# Altium schematic sheet Modem.SchDoc: MODEM
size A4; Author: MOG; CompanyName: GIE GROUP; DrawnBy: MOG; Organization: Gie SA; Address1: Galicia 52; Address2: Mar del Plata; Address3: Buenos Aires; Address4: Argentina; DocumentNumber: 9; Revision: 0.0; SheetNumber: 4; SheetTotal: 14; Project: CP DATALOGGER; PageSetup: Record=PageOptions|CenterHorizontal=True|CenterVertical=True|PrintScale=0.94|XCorrection=1.00|YCorrection=1.00|PrintKind=0|BorderSize=5000000|LeftOffset=0|BottomOffset=0|Orientation=2|PaperLength=1000|PaperWidth=1000|Scale=100|PaperSource=7|PrintQuality=720|MediaType=1|DitherType=10|PaperKind=A4|PrintScaleMode=1
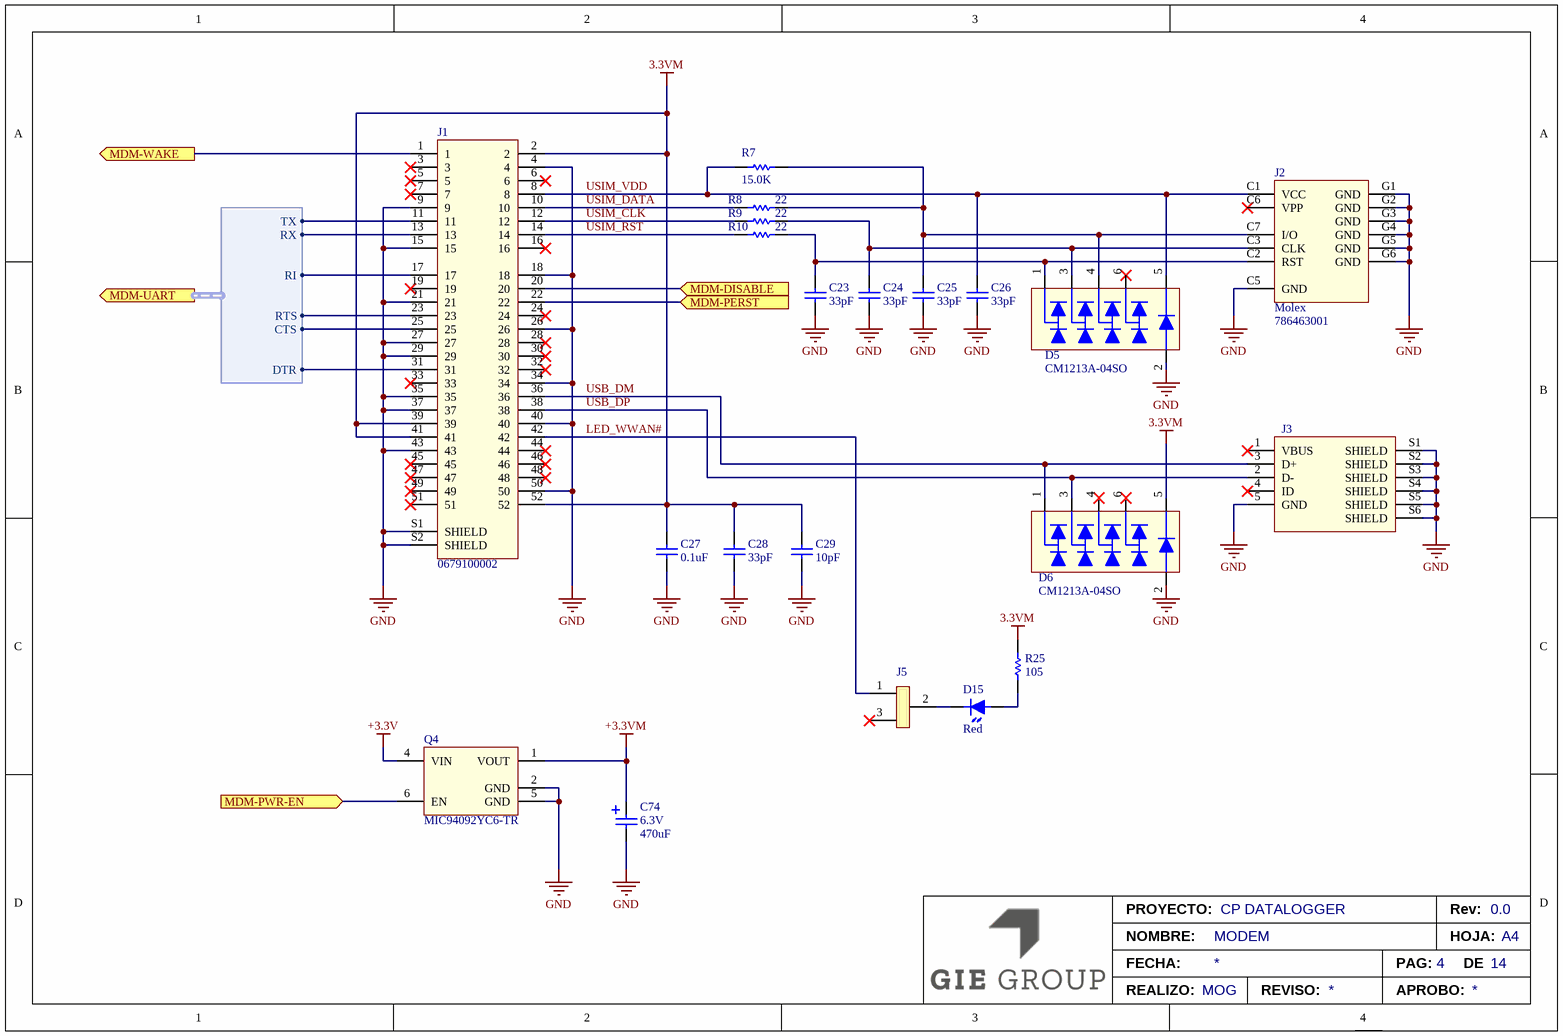
[diagram p0: Modem.SchDoc]

## Parts
C23  value 33pF  [CAP-0603]  (hidden comment: C0603C330F3GAC7867)
C24  value 33pF  [CAP-0603]  (hidden comment: C0603C330F3GAC7867)
C25  value 33pF  [CAP-0603]  (hidden comment: C0603C330F3GAC7867)
C26  value 33pF  [CAP-0603]  (hidden comment: C0603C330F3GAC7867)
C27  value 0.1uF  [CAP-0603]  (hidden comment: C0603C104K5RACAUTO)
C28  value 33pF  [CAP-0603]  (hidden comment: C0603C330F3GAC7867)
C29  value 10pF  [CAP-0603]  (hidden comment: C0603C100K3GAC7867)
C74  value 470uF  Voltage: 6.3V  [CAP_ALUM_SIZE_F]  (hidden comment: EEE-FK0J471P)
D5  CM1213A-04SO  [TSSOP6]
D6  CM1213A-04SO  [TSSOP6]
D15  Color: Red  [0805 - LED]  (hidden comment: LTST-C170KRKT)
J1  0679100002  [MOLEX-679100002]
J2  Manufacturer: Molex  [MOLEX-786463001]  (hidden comment: 786463001)
J3  473460001  [MOLEX-473460001]  (value not drawn)
J5  PRPC003SAAN-RC  [PIN3]  (value not drawn)
Q4  MIC94092YC6-TR  [TSSOP6]
R7  value 15.0K  [RES-0603]  (hidden comment: RC0603FR-0715KL)
R8  value 22  [RES-0603]  (hidden comment: RC0603FR-0722RL)
R9  value 22  [RES-0603]  (hidden comment: RC0603FR-0722RL)
R10  value 22  [RES-0603]  (hidden comment: RC0603FR-0722RL)
R25  value 105  [RES-0603]  (hidden comment: RC0805FR-07100KL)

## Ports
MDM-DISABLE (in), MDM-PERST (in), MDM-PWR-EN (in), MDM-UART (out, harness MDM-UART), MDM-WAKE (out)

## Harnesses
MDM-UART: RX, TX, RI, CTS, RTS, DTR

## Nets
3.3VM: C27.2 C28.2 C29.2 D6.5 J1.2 J1.39 J1.41 J1.52 R25.2
+3.3V: Q4.4(VIN)
+3.3VM: C74.1 Q4.1(VOUT)
GND: C23.1 C24.1 C25.1 C26.1 C27.1 C28.1 C29.1 C74.2 D5.2 D6.2 J1.4 J1.9 J1.15 J1.18 J1.21 J1.26 J1.27 J1.29 J1.34 J1.35 J1.37 J1.40 J1.43 J1.50 J1.S1(SHIELD) J1.S2(SHIELD) J2.C5(GND) J2.G1(GND) J2.G2(GND) J2.G3(GND) J2.G4(GND) J2.G5(GND) J2.G6(GND) J3.5(GND) J3.S1(SHIELD) J3.S2(SHIELD) J3.S3(SHIELD) J3.S4(SHIELD) J3.S5(SHIELD) J3.S6(SHIELD) Q4.2(GND) Q4.5(GND)
LED_WWAN#: J1.42 J5.1
MDM-DISABLE: J1.20 ; port MDM-DISABLE
MDM-PERST: J1.22 ; port MDM-PERST
MDM-PWR-EN: Q4.6(EN) ; port MDM-PWR-EN
MDM-WAKE: J1.1 ; port MDM-WAKE
USB_DM: D6.1 J1.36 J3.3(D+)
USB_DP: D6.3 J1.38 J3.2(D-)
USIM_CLK: J1.12 R9.1
USIM_DATA: J1.10 R8.1
USIM_RST: J1.14 R10.1
USIM_VDD: C26.2 D5.5 J1.8 J2.C1(VCC) R7.1
NetC23_2: C23.2 D5.1 J2.C2(RST) R10.2
NetC24_2: C24.2 D5.3 J2.C3(CLK) R9.2
NetC25_2: C25.2 D5.4 J2.C7(I/O) R7.2 R8.2
NetD15_1: D15.1(A) R25.1
NetD15_2: D15.2(K) J5.2
NetJ1_11: J1.11 ; port MDM-UART.TX
NetJ1_13: J1.13 ; port MDM-UART.RX
NetJ1_17: J1.17 ; port MDM-UART.RI
NetJ1_23: J1.23 ; port MDM-UART.RTS
NetJ1_25: J1.25 ; port MDM-UART.CTS
NetJ1_31: J1.31 ; port MDM-UART.DTR

Not connected (* = marked no-connect by the designer): D5 6*; D6 4* 6*; J1 3* 5* 6* 7* 16* 19* 24* 28* 30* 32* 33* 44* 45* 46* 47* 48* 49* 51*; J2 C6(VPP)*; J3 1(VBUS)* 4(ID)*; J5 3*

## Notes on the sheet
- PROYECTO:
- Rev:
- NOMBRE:
- FECHA:
- REALIZO:
- REVISO:
- APROBO:
- PAG:
- HOJA:
- DE
- A4

## Library data of the parts
C23-C26 C28 = C0603C330F3GAC7867: CAP CER 33 pF 25V C0G 0603; Manufacturer: Kemet; Tolerance: 1%; PartNumber: C0603C330F3GAC7867; Voltage: 25V
C27 = C0603C104K5RACAUTO: CAP CER 0.1uF 50V X7R 0603; Manufacturer: Kemet; Tolerance: 10%; Voltage: 50; PartNumber: C0603C104K5RACAUTO; Supplier 1: Digi-Key; Supplier 2: Mouser; Supplier Part Number 1: 399-6856-1-ND; Supplier Part Number 2: 80-C0603C104K5RAUTO
C29 = C0603C100K3GAC7867: CAP CER 10 pF 25V C0G 0603; Manufacturer: Kemet; Tolerance: 10%; PartNumber: C0603C100K3GAC7867; Voltage: 25V
C74 = EEE-FK0J471P: CAP ALUM 470UF 20% 6.3V SMD; Manufacturer: Panasonic; Part}Number: EEE-FK0J471P
D5 D6 = CM1213A-04SO: TVS DIODE 3.3VWM 10VC 4CH SC74; Manufacturer: OnSemiconductor; PartNumber: CM1213A-04SO
D15 = LTST-C170KRKT: LED RED CLEAR 0805 SMD; Manufacturer: Lite-On Inc; Supplier 1: Digi-Key; Supplier Part Number 1: 160-1415-6-ND; Supplier 2: Mouser; Supplier Part Number 2: 859-LTST-C170KRKT; PartNumber: LTST-C170KRKT
J1 = Molex 0679100002: Connector Mini PCI Express 52POS - Quectel modem; Manufacturer: Molex; PartNumber: 0679100002; Supplier 1: Digi-Key; Supplier Part Number 1: WM3470CT-ND; Supplier 2: Mouser; Supplier Part Number 2: 538-67910-0002
J2 = 786463001: 6 Position Card Connector Micro SIM Surface Mount, Right Angle Gold; Supplier 1: Digi-Key; Supplier 2: Mouser; Supplier Part Number 1: WM9364CT-ND; Supplier Part Number 2: 538-78646-3001; PartNumber: 786463001
J3 = 473460001: USB Connectors MICRO USB B RECPT BTTM MOUNT ASSY; Manufacturer: Molex; PartNumber: 473460001
J5 = PRPC003SAAN-RC: CONN HEADER .100" SNGL STR 3POS; Manufacturer: Sullins Connector Solutions; PartNumber: PRPC003SAAN-RC; Supplier 1: Digi-Key; Supplier Part Number 1: S1011EC-03-ND
Q4 = MIC94092YC6-TR: Manufacturer: Microchip; PartNUmber: MIC94092YC6-TR
R7 = RC0603FR-0715KL: RES SMD 15.0K OHM 1% 1/10W 0603; Manufacturer: Yageo; Power: 0.1W; Tolerance: 1%; PartNumber: RC0603FR-0715KL
R8-R10 = RC0603FR-0722RL: RES SMD 22 OHM 1% 1/10W 0603; Manufacturer: Yageo; Power: 0.1W; Tolerance: 1%; PartNumber: RC0603FR-0722RL
R25 = RC0805FR-07105RL: RES SMD 105 OHM 1% 1/8W 0805; Manufacturer: Yageo; Power: 0.125W; Tolerance: 1%; PartNumber: RC0805FR-07100KL; Supplier 1: Digi-Key; Supplier Part Number 1: 311-100KCRCT-ND; Supplier 2: Mouser; Supplier Part Number 2: 603-RC0805FR-07100KL